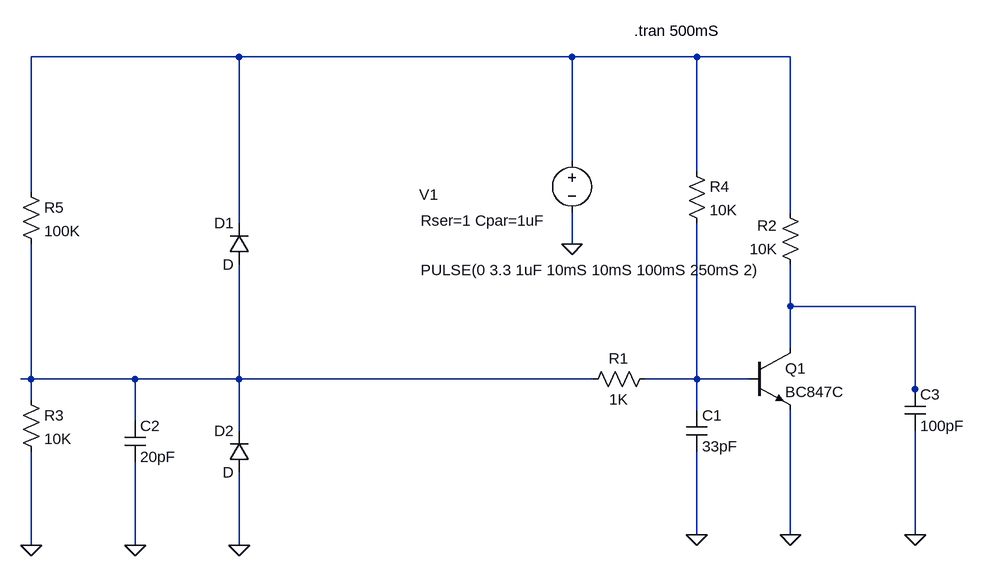
[diagram p0: schematic power_up_down.asc]
power_up_down.asc, the LTspice schematic file:
Version 4
SHEET 1 880 680
WIRE -608 -304 -928 -304
WIRE -96 -304 -608 -304
WIRE 96 -304 -96 -304
WIRE 240 -304 96 -304
WIRE -96 -144 -96 -304
WIRE 96 -128 96 -304
WIRE -928 -96 -928 -304
WIRE 240 -64 240 -304
WIRE -608 -48 -608 -304
WIRE -96 -16 -96 -64
WIRE 240 80 240 16
WIRE 432 80 240 80
WIRE 240 144 240 80
WIRE -928 192 -928 -16
WIRE -928 192 -944 192
WIRE -768 192 -928 192
WIRE -608 192 -608 16
WIRE -608 192 -768 192
WIRE -64 192 -608 192
WIRE 96 192 96 -48
WIRE 96 192 16 192
WIRE 176 192 96 192
WIRE 432 208 432 80
WIRE -928 224 -928 192
WIRE 432 224 432 208
WIRE 96 240 96 192
WIRE -768 256 -768 192
WIRE -608 272 -608 192
WIRE 96 432 96 304
WIRE 240 432 240 240
WIRE 432 432 432 272
WIRE -928 448 -928 304
WIRE -768 448 -768 320
WIRE -608 448 -608 336
FLAG 240 432 0
FLAG 96 432 0
FLAG -96 -16 0
FLAG -608 448 0
FLAG -928 448 0
FLAG -768 448 0
FLAG 432 432 0
SYMBOL res 32 176 R90
WINDOW 0 0 56 VBottom 2
WINDOW 3 32 56 VTop 2
SYMATTR InstName R1
SYMATTR Value 1K
SYMBOL res 256 32 R180
WINDOW 0 36 76 Left 2
WINDOW 3 36 40 Left 2
SYMATTR InstName R2
SYMATTR Value 10K
SYMBOL npn 176 144 R0
SYMATTR InstName Q1
SYMATTR Value BC847C
SYMBOL cap 80 240 R0
SYMATTR InstName C1
SYMATTR Value 33pF
SYMBOL voltage -96 -160 R0
WINDOW 0 -235 68 Left 2
WINDOW 3 -233 184 Left 2
WINDOW 123 0 0 Left 0
WINDOW 39 -233 108 Left 2
SYMATTR InstName V1
SYMATTR Value PULSE(0 3.3 1uF 10mS 10mS 100mS 250mS 2)
SYMATTR SpiceLine Rser=1 Cpar=1uF
SYMBOL diode -592 16 R180
WINDOW 0 24 64 Left 2
WINDOW 3 24 0 Left 2
SYMATTR InstName D1
SYMBOL diode -592 336 R180
WINDOW 0 24 64 Left 2
WINDOW 3 24 0 Left 2
SYMATTR InstName D2
SYMBOL res -944 208 R0
SYMATTR InstName R3
SYMATTR Value 10K
SYMBOL cap -784 256 R0
SYMATTR InstName C2
SYMATTR Value 20pF
SYMBOL res -944 -112 R0
SYMATTR InstName R5
SYMATTR Value 100K
SYMBOL cap 416 208 R0
SYMATTR InstName C3
SYMATTR Value 100pF
SYMBOL res 80 -144 R0
SYMATTR InstName R4
SYMATTR Value 10K
TEXT 0 -344 Left 2 !.tran 500mS

The netlist it stands for:
* power_up_down.asc
R1 N004 N003 1K
R2 N002 N001 10K
Q1 N002 N004 0 0 BC847C
C1 N004 0 33pF
V1 N001 0 PULSE(0 3.3 1uF 10mS 10mS 100mS 250mS 2) Rser=1 Cpar=1uF
D1 N003 N001 D
D2 0 N003 D
R3 N003 0 10K
C2 N003 0 20pF
R5 N001 N003 100K
C3 N002 0 100pF
R4 N001 N004 10K
.model D D
.lib standard.dio
.model NPN NPN
.model PNP PNP
.lib standard.bjt
.tran 500mS
.backanno
.end